# Altium schematic sheet pitcomm.SchDoc
size A4; Organization: Altium Limited; Address1: L3, 12a Rodborough Rd; Address2: Frenchs Forest; Address3: NSW; Address4: Australia 2086
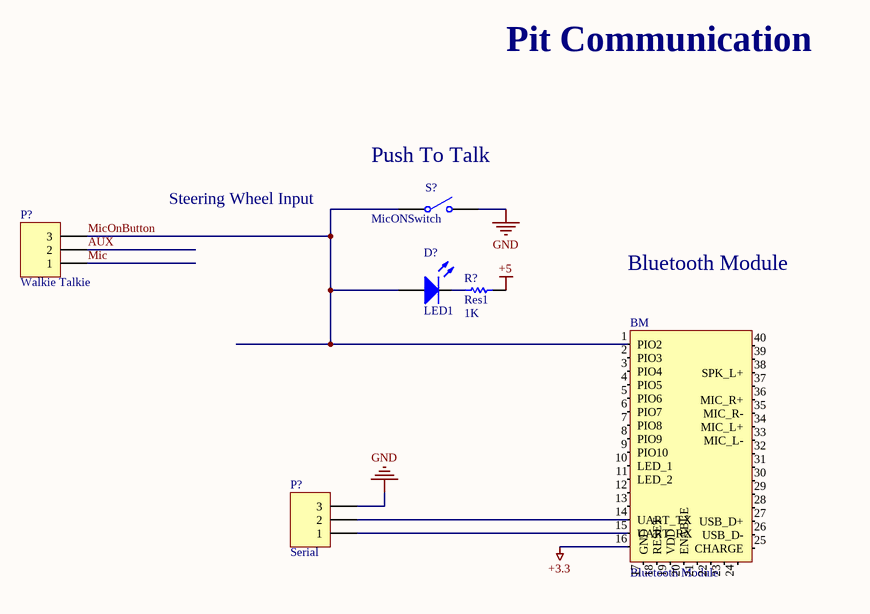
[diagram p0: pitcomm.SchDoc]

## Parts
(Parts that share a designator on the sheet are numbered #1, #2 ... from top to bottom, then left to right.)
BM  Bluetooth Module
D?  LED1  [LED-1]
P?#1  Walkie Talkie  [HDR1X3]
P?#2  Serial  [HDR1X3]
R?  Res1  value 1K  [AXIAL-0.3]
S?  MicONSwitch  [SPST-2]

## Nets
+3.3: BM.16
+5: R?.2
GND: P?#2.3 S?.2(NO)
AUX: P?#1.2
Mic: P?#1.1
MicOnButton: BM.1(PIO2) D?.1(A) P?#1.3 S?.1(COMMON)
NetBM_14: BM.14(UART_TX) P?#2.2
NetBM_15: BM.15(UART_RX) P?#2.1
NetD?_2: D?.2(K) R?.1

Not connected (* = marked no-connect by the designer): BM 2(PIO3) 3(PIO4) 4(PIO5) 5(PIO6) 6(PIO7) 7(PIO8) 8(PIO9) 9(PIO10) 10(LED_1) 11(LED_2) 12 13 17(GND) 18(RESET) 19(VDD) 20(ENABLE) 21 22 23 24 25(CHARGE) 26(USB_D-) 27(USB_D+) 28 29 30 31 32 33(MIC_L-) 34(MIC_L+) 35(MIC_R-) 36(MIC_R+) 37 38(SPK_L+) 39 40

## Notes on the sheet
- Pit Communication
- (near S?) Push To Talk
- Steering Wheel Input
- Bluetooth Module
- Title
- Size:
- Date:
- A4
- Number:
- Time:
- Revision:
- Sheet
- of
- File:

## Library data of the parts
BM = KC6112
D? = LED1: Typical RED GaAs LED; Published: 8-Jun-2000; LatestRevisionDate: 08-Jul-2005; LatestRevisionNote: Mech Layer 1 removed.; PackageReference: LED-1; Publisher: Altium Limited; PackageDescription: LED; 2 Leads
P?#1 P?#2 = Header 3: Header, 3-Pin; LatestRevisionDate: 17-Jul-2002; LatestRevisionNote: Re-released for DXP Platform.; Publisher: Altium Limited
R? = Res1: Resistor; Published: 8-Jun-2000; LatestRevisionDate: 17-Jul-2002; LatestRevisionNote: Re-released for DXP Platform.; PackageReference: AXIAL-0.3; Publisher: Altium Limited; PackageDescription: Axial Device, Thru-Hole; 2 Leads; 0.3 in Pin Spacing
S? = SW-SPST: Single-Pole, Single-Throw Switch; Published: 24-Mar-1999; LatestRevisionDate: 17-Jul-2002; LatestRevisionNote: Re-released for DXP Platform.; PackageReference: SPST-2; Publisher: Altium Limited; PackageDescription: Switch; 2 Leads